# Altium schematic sheet BSPD Schematic.SchDoc
size A; SheetNumber: 1; SheetTotal: 1; SPICEModelCacheDTURKZNI: <root> / <DocumentId>DTURKZNI</DocumentId> / </root>
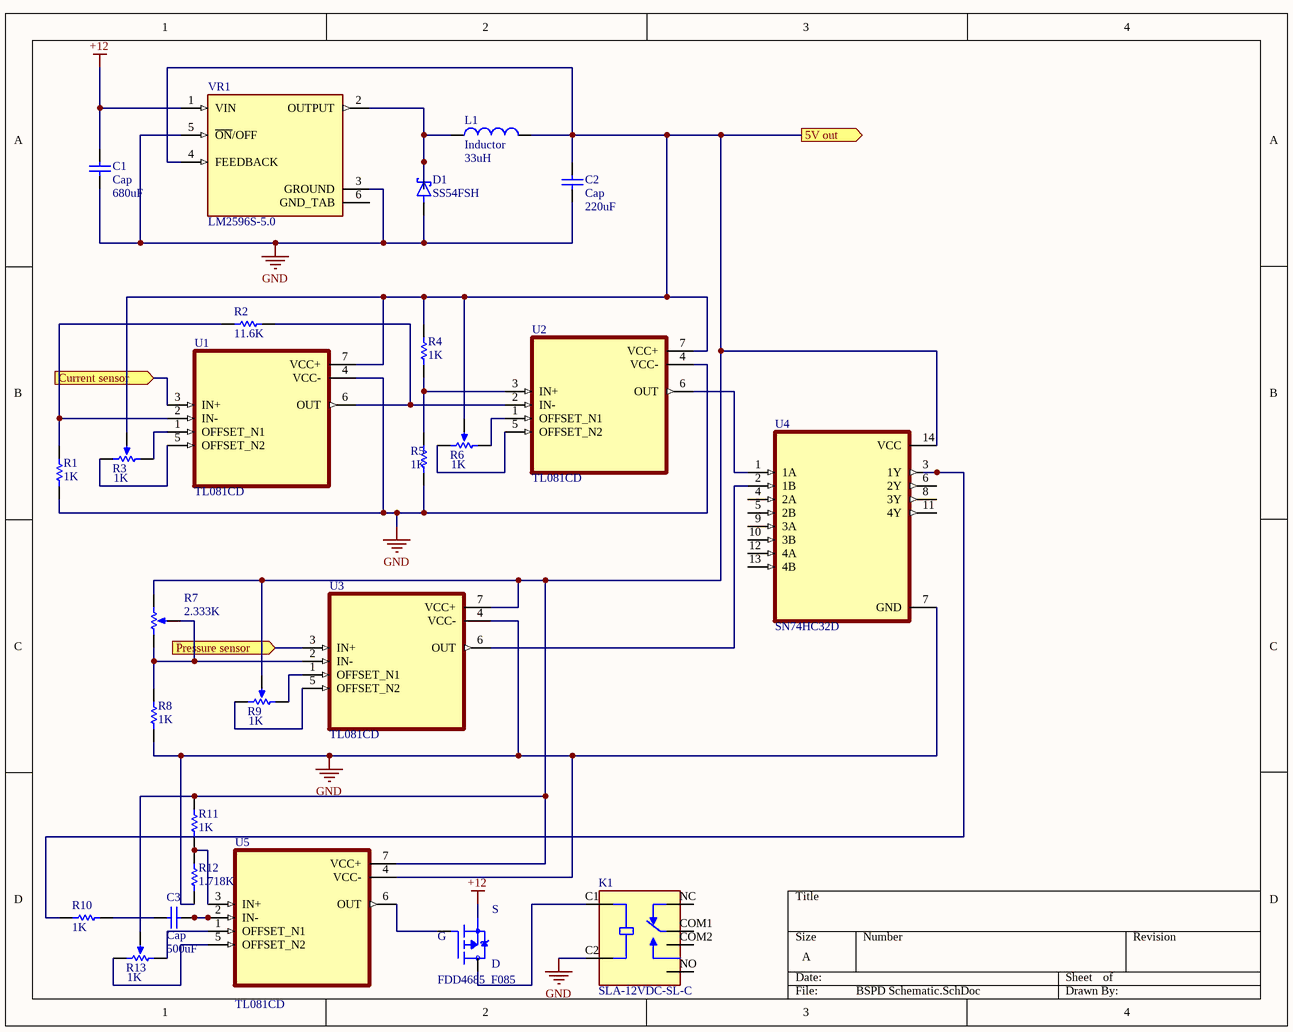
[diagram p0: BSPD Schematic.SchDoc]

## Parts
?  FDD4685_F085  [D2PACK]
C1  Cap  value 680uF  [RAD-0.3]
C2  Cap  value 220uF  [RAD-0.3]
C3  Cap  value 500uF  [RAD-0.3]
D1  SS54FSH  [SODFL4725X110N]
K1  SLA-12VDC-SL-C  [RELAY_SLA-12VDC-SL-C]
L1  Inductor  value 33uH  [0402-A]
R1  value 1K  (hidden comment: Resistor)
R2  value 11.6K  (hidden comment: Resistor)
R3  value 1K  [VR5]
R4  value 1K  (hidden comment: Resistor)
R5  value 1K  (hidden comment: Resistor)
R6  value 1K  [VR5]
R7  value 2.333K  [VR5]
R8  value 1K  (hidden comment: Resistor)
R9  value 1K  [VR5]
R10  value 1K  (hidden comment: Resistor)
R11  value 1K  (hidden comment: Resistor)
R12  value 1.718K  (hidden comment: Resistor)
R13  value 1K  [VR5]
U1  TL081CD  [SOIC127P599X175-8N]
U2  TL081CD  [SOIC127P599X175-8N]
U3  TL081CD  [SOIC127P599X175-8N]
U4  SN74HC32D  [SOIC127P600X175-14N]
U5  TL081CD  [SOIC127P599X175-8N]
VR1  LM2596S-5.0  [TO170P1524X483-6N]

## Ports
5V out (out), Current sensor (in), Pressure sensor (in)

## Nets
+12: ?.3_S(S) C1.2 VR1.1(VIN)
GND: C1.1 C2.1 D1.A K1.C2(COIL2) R1.1 R5.1 R8.1 R12.2 U1.4(VCC-) U2.4(VCC-) U3.4(VCC-) U4.7(GND) U5.4(VCC-) VR1.3(GROUND) VR1.5(~{ON}/OFF)
5V out: C2.2 L1.2 R3.3(TAP) R4.2 R6.3(TAP) R7.2(BOT) R9.3(TAP) R11.1 R13.3(TAP) U1.7(VCC+) U2.7(VCC+) U3.7(VCC+) U4.14(VCC) U5.7(VCC+) VR1.4(FEEDBACK) ; port 5V out
Current sensor: U1.3(IN+) ; port Current sensor
Pressure sensor: U3.3(IN+) ; port Pressure sensor
Net?_1_G: ?.1_G(G) U5.6(OUT)
Net?_2_D: ?.2_D(D) K1.C1(COIL1)
NetC3_1: C3.1 U5.2(IN-)
NetC3_2: C3.2 R10.1
NetD1_C: D1.C(K) L1.1 VR1.2(OUTPUT)
NetR1_2: R1.2 R2.2 U1.2(IN-)
NetR2_1: R2.1 U1.6(OUT) U2.2(IN-)
NetR3_1: R3.1(TOP) U1.1(OFFSET_N1)
NetR3_2: R3.2(BOT) U1.5(OFFSET_N2)
NetR4_1: R4.1 R5.2 U2.3(IN+)
NetR6_1: R6.1(TOP) U2.1(OFFSET_N1)
NetR6_2: R6.2(BOT) U2.5(OFFSET_N2)
NetR7_1: R7.1(TOP) R7.3(TAP) R8.2 U3.2(IN-)
NetR9_1: R9.1(TOP) U3.1(OFFSET_N1)
NetR9_2: R9.2(BOT) U3.5(OFFSET_N2)
NetR10_2: R10.2 U4.3(1Y)
NetR11_2: R11.2 R12.1 U5.3(IN+)
NetR13_1: R13.1(TOP) U5.1(OFFSET_N1)
NetR13_2: R13.2(BOT) U5.5(OFFSET_N2)
NetU2_6: U2.6(OUT) U4.1(1A)
NetU3_6: U3.6(OUT) U4.2(1B)

Not connected (* = marked no-connect by the designer): K1 COM1(COM) COM2(COM) NC NO; U4 4(2A) 5(2B) 6(2Y) 8(3Y) 9(3A) 10(3B) 11(4Y) 12(4A) 13(4B); VR1 6(GND_TAB)

## Library data of the parts
? = FDD4685_F085: P-Channel 40V 8.4A _Ta_, 32A _Tc_ 83W _Tc_ Surface Mount D-PAK _TO-252AA_; MF: ON Semiconductor; Value: *; Price: None; Package: None; SnapEDA_Link: https://www.snapeda.com/parts/FDD4685_F085/ON%20Semiconductor/view-part/2771459/?ref=snap; Availability: Unavailable; MP: FDD4685_F085
C1-C3 = Cap: Capacitor; Published: 8-Jun-2000; LatestRevisionDate: 17-Jul-2002; LatestRevisionNote: Re-released for DXP Platform.; PackageReference: RAD-0.3; Publisher: Altium Limited; PackageDescription: Radial Cap, Thru-Hole; 2 Leads; 0.3 in Pin Spacing
D1 = SS54FSH: 5A, 40V, Schottky Rectifier; MF: Taiwan Semiconductor; Value: *; SnapEDA_Link: https://www.snapeda.com/parts/SS54FSH/Taiwan+Semiconductor/view-part/?ref=snap; MP: SS54FSH; Check_prices: https://www.snapeda.com/parts/SS54FSH/Taiwan+Semiconductor/view-part/?ref=eda; Availability: In Stock; Price: None; Package: SOD-128-2 Taiwan Semiconductor
K1 = SLA-12VDC-SL-C: SUBMINATURE HIGH POWER RELAY; MF: Songle Relay; Value: *; SnapEDA_Link: https://www.snapeda.com/parts/SLA-12VDC-SL-C/Songle+Relay/view-part/?ref=snap; MP: SLA-12VDC-SL-C; Check_prices: https://www.snapeda.com/parts/SLA-12VDC-SL-C/Songle+Relay/view-part/?ref=eda; Availability: Not in stock; Price: None; Package: None
L1 = Inductor: Code_IEC: 1005; Published: 8-Jun-2000; LatestRevisionDate: 29-May-2009; LatestRevisionNote: IPC-7351 Footprint Added.; PackageReference: 0402-A; Publisher: Altium Limited; PackageDescription: Chip Inductor; Code_JEITA: 0402
R1 R2 R4 R5 R8 R10-R12 = Resistor: TC1: 0; SimulationGenericComponent: True; TC2: 0
R3 R6 R7 R9 R13 = RPot: Potentiometer; Sim Note: Enter the Resistance value and the set point into parameter fields.; Set Position: 0.5; Published: 8-Jun-2000; LatestRevisionDate: 17-Jul-2002; LatestRevisionNote: Re-released for DXP Platform.; PackageReference: VR5; Publisher: Altium Limited; PackageDescription: Variable Resistor, Thru-Hole; 3 Leads
U1-U3 U5 = TL081CD: High Slew Rate JFET-Input Operational Amplifier 8-SOIC 0 to 70; MF: Texas Instruments; Package: SOIC-8 Texas Instruments; SnapEDA_Link: https://www.snapeda.com/parts/TL081CD/Texas%20Instruments/view-part/4793911/?ref=snap; MP: TL081CD; Availability: Good; Price: None; Value: *; Purchase-URL: https://pricing.snapeda.com/search/part/TL081CD/?ref=eda
VR1 = LM2596S-5.0: SIMPLE SWITCHER&reg; 4.5V to 40V, 3A Low Component Count Step-Down Regulator; MP: LM2596S-5.0/NOPB; MF: Texas Instruments; Price: None; Availability: In Stock; Package: TO-263-5 Texas Instruments; SnapEDA_Link: https://www.snapeda.com/parts/LM2596S-5.0/NOPB/Texas+Instruments/view-part/?ref=snap; Check_prices: https://www.snapeda.com/parts/LM2596S-5.0/NOPB/Texas+Instruments/view-part/?ref=eda; Value: *; Purchase-URL: https://pricing.snapeda.com/search/part/LM2596S-5.0/NOPB/?ref=eda
U4 = SN74HC32D: Package: None; Price: None; Value: *; MP: SN74HC32D; Availability: Unavailable